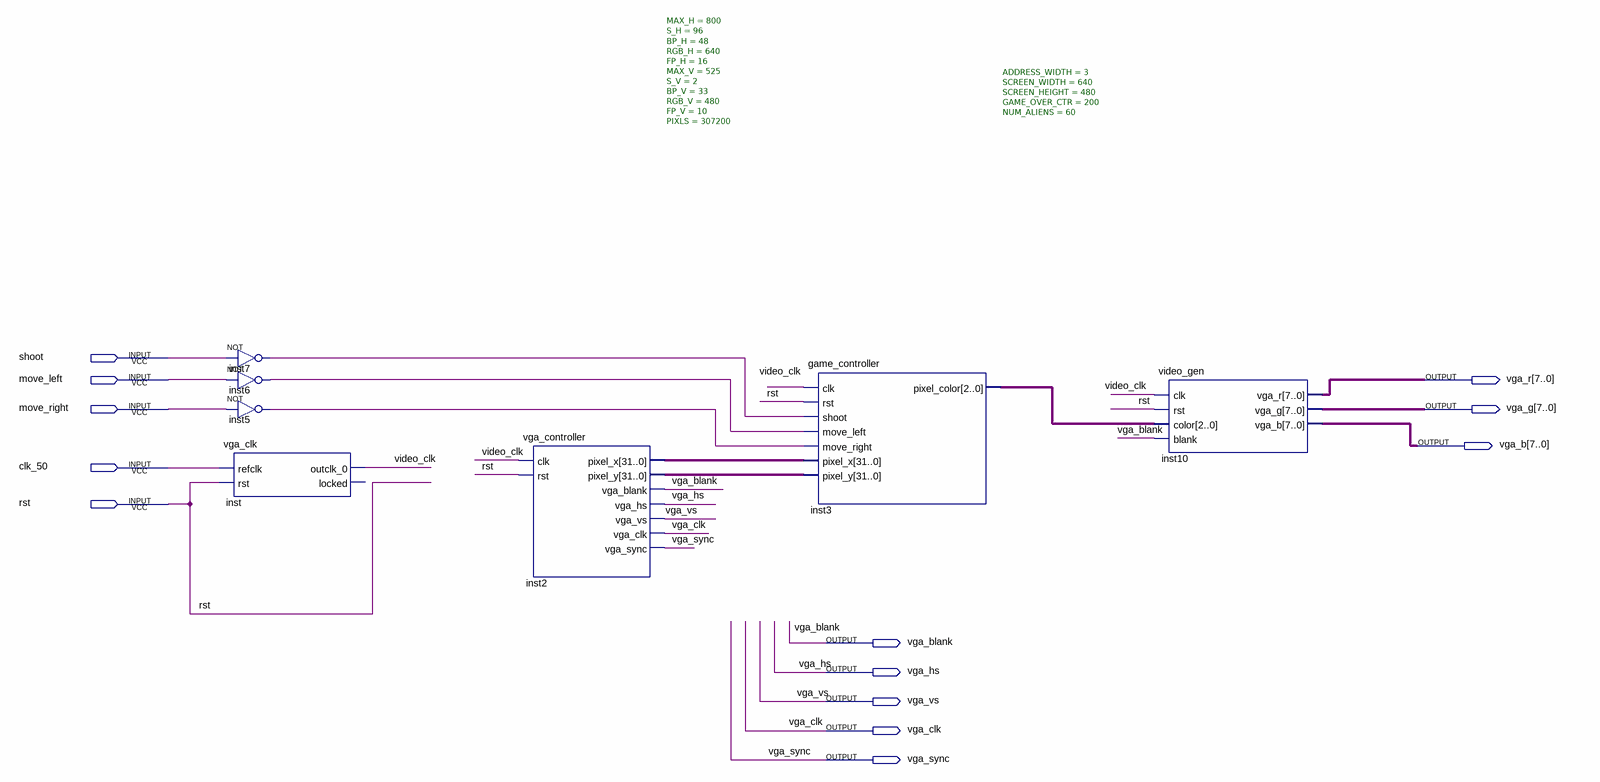
[diagram p0: schematic sheet]
// Quartus schematic vhdl_space_invaders_top.bdf as structural Verilog: 7 symbols, 13 pins
module vhdl_space_invaders_top (
  input  shoot,
  input  move_left,
  input  move_right,
  input  clk_50,
  input  rst,
  output [7:0] vga_r,
  output [7:0] vga_g,
  output [7:0] vga_b,
  output vga_blank,
  output vga_hs,
  output vga_vs,
  output vga_clk,
  output vga_sync
);

  wire inst5_out, inst6_out, inst7_out, video_clk;
  wire [2:0] inst3_pixel_color;
  wire [31:0] inst2_pixel_x, inst2_pixel_y;

  not inst7 (inst7_out, shoot);
  not inst6 (inst6_out, move_left);
  not inst5 (inst5_out, move_right);
  vga_clk inst (.refclk(clk_50), .rst(rst), .outclk_0(video_clk));  // open: locked
  vga_controller #(.MAX_H(800), .S_H(96), .BP_H(48), .RGB_H(640), .FP_H(16), .MAX_V(525), .S_V(2), .BP_V(33), .RGB_V(480), .FP_V(10), .PIXLS(307200)) inst2 (
    .clk(video_clk), .rst(rst), .pixel_x(inst2_pixel_x), .pixel_y(inst2_pixel_y), .vga_blank(vga_blank),
    .vga_hs(vga_hs), .vga_vs(vga_vs), .vga_clk(vga_clk), .vga_sync(vga_sync));
  game_controller #(.ADDRESS_WIDTH(3), .SCREEN_WIDTH(640), .SCREEN_HEIGHT(480), .GAME_OVER_CTR(200), .NUM_ALIENS(60)) inst3 (
    .clk(video_clk), .rst(rst), .shoot(inst7_out), .move_left(inst6_out), .move_right(inst5_out),
    .pixel_x(inst2_pixel_x), .pixel_y(inst2_pixel_y), .pixel_color(inst3_pixel_color));
  video_gen inst10 (
    .clk(video_clk), .rst(rst), .color(inst3_pixel_color), .blank(vga_blank), .vga_r(vga_r), .vga_g(vga_g),
    .vga_b(vga_b));
endmodule
